# Altium schematic sheet rotenc.SchDoc
size A4; PageSetup: Record=PageOptions|CenterHorizontal=True|CenterVertical=True|PrintScale=0.97|XCorrection=1.00|YCorrection=1.00|PrintKind=0|BorderSize=5000000|LeftOffset=0|BottomOffset=0|Orientation=2|PaperLength=1000|PaperWidth=1000|Scale=100|PaperSource=7|PrintQuality=-4|MediaType=1|DitherType=10|PaperKind=A4|PrintScaleMode=1
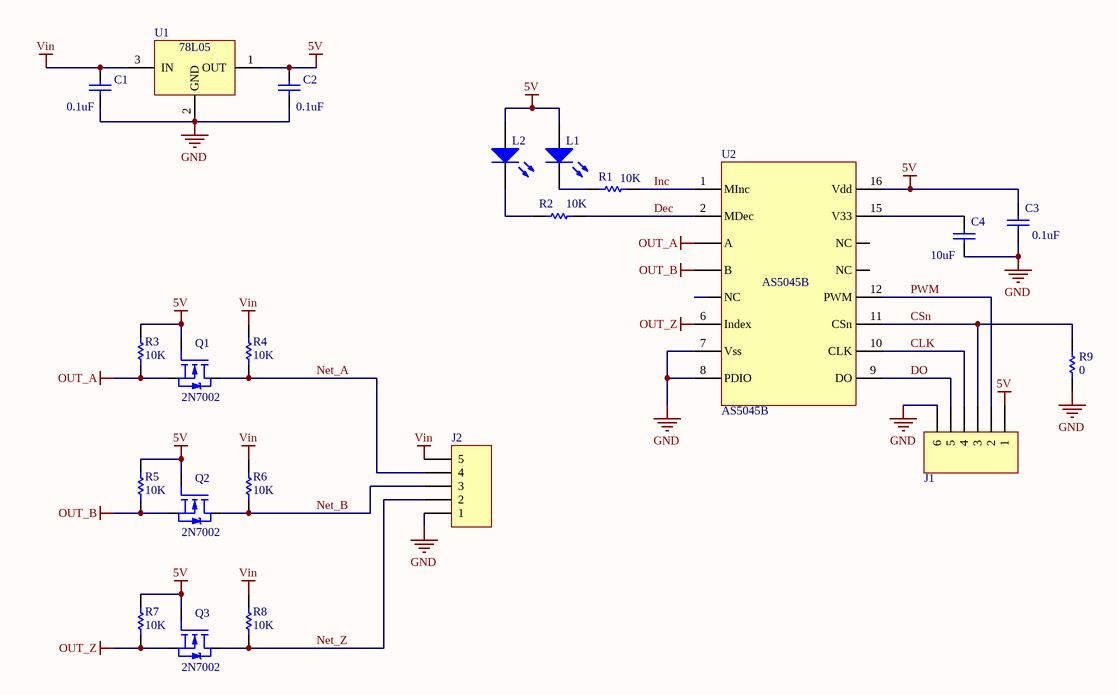
[diagram p0: rotenc.SchDoc]

## Parts
C1  0.1uF  [CAP0805]
C2  0.1uF  [CAP0805]
C3  0.1uF  [CAP0805]
C4  10uF  [CAP0805]
J1  Header 6  [J6]  (value not drawn)
J2  Header 5  [A1254_5P]  (value not drawn)
L1  Red  [LED2R]  (value not drawn)
L2  Green  [LED2G]  (value not drawn)
Q1  2N7002  [SOT23_NMOS]
Q2  2N7002  [SOT23_NMOS]
Q3  2N7002  [SOT23_NMOS]
R1  value 10K  [RES0805]  (hidden comment: Resistor)
R2  value 10K  [RES0805]  (hidden comment: Resistor)
R3  value 10K  [RES0805]  (hidden comment: Resistor)
R4  value 10K  [RES0805]  (hidden comment: Resistor)
R5  value 10K  [RES0805]  (hidden comment: Resistor)
R6  value 10K  [RES0805]  (hidden comment: Resistor)
R7  value 10K  [RES0805]  (hidden comment: Resistor)
R8  value 10K  [RES0805]  (hidden comment: Resistor)
R9  value 0  [RES0805]  (hidden comment: Resistor)
U1  78L05  [SOT89_VREG]  (value not drawn)
U2  AS5045B  [SSOP16]

## Nets
5V: C2.2 C3.1 J1.1 L1.1(A) L2.1(A) Q1.G Q2.G Q3.G R3.2 R5.2 R7.2 U1.1(OUT) U2.16(Vdd)
GND: C1.1 C2.1 C3.2 C4.2 J1.6 J2.1 R9.1 U1.2(GND) U2.7(Vss) U2.8(PDIO)
OUT_A: Q1.S R3.1 U2.3(A)
OUT_B: Q2.S R5.1 U2.4(B)
OUT_Z: Q3.S R7.1 U2.6(Index)
Vin: C1.2 J2.5 R4.2 R6.2 R8.2 U1.3(IN)
CLK: J1.4 U2.10(CLK)
CSn: J1.3 R9.2 U2.11(CSn)
Dec: R2.2 U2.2(MDec)
DO: J1.5 U2.9(DO)
Inc: R1.2 U2.1(MInc)
Net_A: J2.4 Q1.D R4.1
Net_B: J2.3 Q2.D R6.1
Net_Z: J2.2 Q3.D R8.1
PWM: J1.2 U2.12(PWM)
NetC4_1: C4.1 U2.15(V33)
NetL1_2: L1.2(K) R1.1
NetL2_2: L2.2(K) R2.1

Not connected (* = marked no-connect by the designer): U2 5(NC) 13(NC) 14(NC)

## Library data of the parts
C1-C4 = Cap: 0805电容; Published: 8-Jun-2000; LatestRevisionDate: 17-Jul-2002; LatestRevisionNote: Re-released for DXP Platform.; Publisher: Altium Limited
  C1-C3: Value: 0.1uF
  C4: Value: 10uF
J1 = Header 6: 选焊6P; LatestRevisionDate: 17-Jul-2002; LatestRevisionNote: Re-released for DXP Platform.; Publisher: Altium Limited
J2 = Header 5: 贴片接口5P; LatestRevisionDate: 17-Jul-2002; LatestRevisionNote: Re-released for DXP Platform.; Publisher: Altium Limited
L1 = LED: 高亮红LED; Published: 8-Jun-2000; LatestRevisionDate: 08-Jul-2005; LatestRevisionNote: Mech Layer 1 removed.; PackageReference: LED-0; Publisher: Altium Limited; PackageDescription: LED; 2 Leads
L2 = LED: 高亮绿LED; Published: 8-Jun-2000; LatestRevisionDate: 08-Jul-2005; LatestRevisionNote: Mech Layer 1 removed.; PackageReference: LED-0; Publisher: Altium Limited; PackageDescription: LED; 2 Leads
Q1-Q3 = NMOS: 贴片MOS管; Published: 8-Jun-2000; LatestRevisionDate: 17-Jul-2002; LatestRevisionNote: Re-released for DXP Platform.; PackageVersion: 1995/1996; PackageReference: E3; Publisher: Altium Limited; PackageDescription: TO, Flat Index; 3 In-Line, Axial Leads; Body Dia. 4.6mm; Lead Dia. 0.5 mm (max)
R1-R9 = Res1: 0805电阻; Published: 8-Jun-2000; LatestRevisionDate: 17-Jul-2002; LatestRevisionNote: Re-released for DXP Platform.; PackageReference: AXIAL-0.3; Publisher: Altium Limited; PackageDescription: Axial Device, Thru-Hole; 2 Leads; 0.3 in Pin Spacing
U1 = 78L05: 贴片稳压; Published: 24-Aug-2001; LatestRevisionDate: 6-Jun-2005; LatestRevisionNote: PCB pads lengthened.; DatasheetDocument: Apr-1994; PackageDocument: Jun-2004; PackageReference: TO-252; Publisher: Altium Limited; ComponentLink1Description: Manufacturer Link; ComponentLink1URL: http://www.st.com/
U2 = AS5045B: 编码器IC